# EAGLE design ver1.8 (EAGLE 9.6.2)
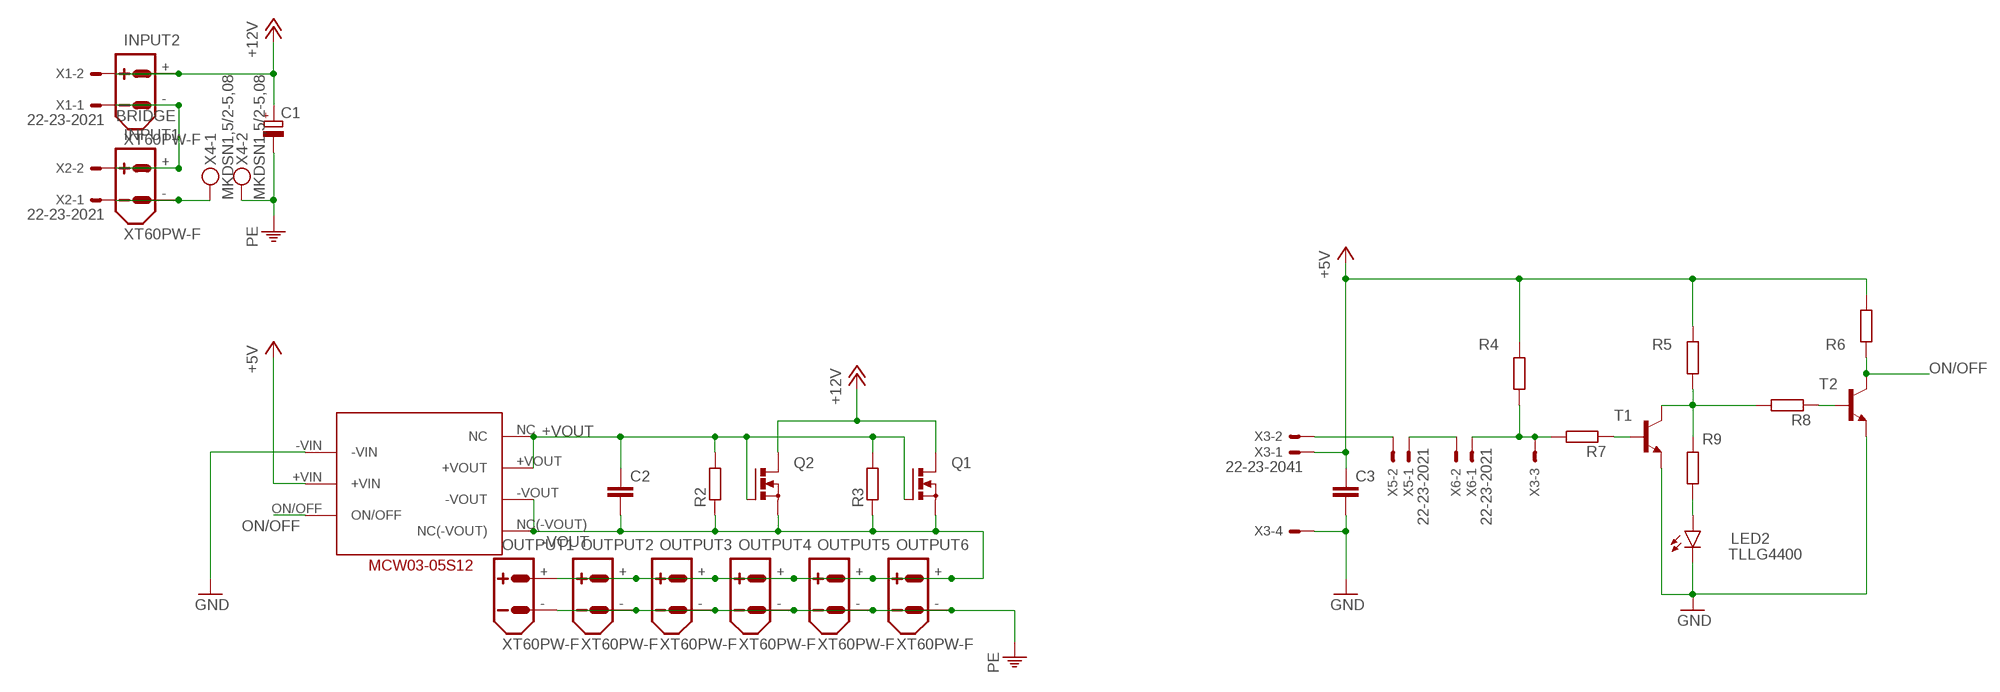
[diagram p0: schematic, sheet 1]

## Parts
C1  CPOL-EUE3.5-10  [E3,5-10]
C2  C-EU025-030X050  [C025-030X050]
C3  C-EU025-030X050  [C025-030X050]
INPUT1  XT60PW-F  [XT60PW-F]
INPUT2  XT60PW-F  [XT60PW-F]
LED2  TLLG4400  [LED3MM]
OUTPUT1  XT60PW-F  [XT60PW-F]
OUTPUT2  XT60PW-F  [XT60PW-F]
OUTPUT3  XT60PW-F  [XT60PW-F]
OUTPUT4  XT60PW-F  [XT60PW-F]
OUTPUT5  XT60PW-F  [XT60PW-F]
OUTPUT6  XT60PW-F  [XT60PW-F]
Q1  PMOSFET_NTO220BV  [TO220BV]
Q2  PMOSFET_NTO220BV  [TO220BV]
R2  R-EU_0204/5  [0204/5]
R3  R-EU_0204/5  [0204/5]
R4  R-EU_0204/5  [0204/5]
R5  R-EU_0204/5  [0204/5]
R6  R-EU_0204/5  [0204/5]
R7  R-EU_0204/5  [0204/5]
R8  R-EU_0204/5  [0204/5]
R9  R-EU_0204/5  [0204/5]
T1  -NPN-TO92-ECB  [TO92-ECB]
T2  -NPN-TO92-ECB  [TO92-ECB]
U$3  MCW03-05S12  [MCW03-05S12]
X1  22-23-2021  [22-23-2021]
X2  22-23-2021  [22-23-2021]
X3  22-23-2041  [22-23-2041]
X4  MKDSN1,5/2-5,08  [MKDSN1,5/2-5,08]
X5  22-23-2021  [22-23-2021]
X6  22-23-2021  [22-23-2021]

## Nets
+5V: C3.1 R4.2 R5.2 R6.2 U$3.+VIN X3.1
+12V: C1.+ INPUT2.+ Q1.D Q2.D X1.2
+VOUT: C2.1 Q1.G Q2.G R2.2 R3.2 U$3.+VOUT U$3.NC
-VOUT: C2.2 OUTPUT1.+ OUTPUT2.+ OUTPUT3.+ OUTPUT4.+ OUTPUT5.+ OUTPUT6.+ Q1.S Q2.S R2.1 R3.1 U$3.-VOUT U$3.NC(-VOUT)
BRIDGE: INPUT1.+ INPUT2.- X1.1 X2.2
GND: C3.2 LED2.K(C) T1.E T2.E U$3.-VIN X3.4
N$1: INPUT1.- X2.1 X4.1
N$7: X3.2 X5.2
N$8: X5.1 X6.2
N$9: R4.1 R7.2 X3.3 X6.1
N$10: R7.1 T1.B
N$12: R5.1 R8.2 R9.1 T1.C
N$14: R8.1 T2.B
N$15: LED2.A R9.2
ON/OFF: R6.1 T2.C U$3.ON/OFF
PE: C1.- OUTPUT1.- OUTPUT2.- OUTPUT3.- OUTPUT4.- OUTPUT5.- OUTPUT6.- X4.2

## Library data of the parts
C1 = rcl:CPOL-EU: POLARIZED CAPACITOR, European symbol; SPICEPREFIX: C
C2 C3 = rcl:C-EU: CAPACITOR, European symbol; SPICEPREFIX: C
INPUT1 INPUT2 OUTPUT1-OUTPUT6 = amass:XT60: AMASS XT60 connector Store in Japan AMASS XT60 connector <https://szc.jp/ams-xt60>
LED2 = led:TLLG4400: Low Current (2mA) LED 3 mm Tinted Diffused Package color GREEN Source: Data sheet <http://www.farnell.com/datasheets/391098.pdf>; MF: VISHAY SEMICONDUCTOR; OC_FARNELL: 1612435
Q1 Q2 = transistor-power:PMOSFET_N: Power MOSFET N-Channel
R2-R9 = rcl:R-EU_: RESISTOR, European symbol; SPICEPREFIX: R
T1 T2 = transistor:*-NPN-: NPN Transistror BF959 corrected 2008.03.06
U$3 = MCW03-05S12:MCW03-05S12
X1 X2 X5 X6 = con-molex:22-23-2021: .100" (2.54mm) Center Header - 2 Pin; MF: MOLEX; MPN: 22-23-2021; OC_FARNELL: 1462926; OC_NEWARK: 25C3832
X3 = con-molex:22-23-2041: .100" (2.54mm) Center Header - 4 Pin; MF: MOLEX; MPN: 22-23-2041; OC_FARNELL: 1462920; OC_NEWARK: 38C0355
X4 = con-phoenix-508:MKDSN1,5/2-5,08: MKDSN 1,5/ 2-5,08 Printklemme Nennstrom: 13,5 A Nennspannung: 250 V Rastermaß: 5,08 mm Polzahl: 2 Anschlussart: Schraubanschluss Montage: Löten Anschlussrichtung Leiter/Platine: 0 ° Artikelnummer: 1729128 Source: http://eshop.phoenixcontact.com .. 1729128.pdf

## Board
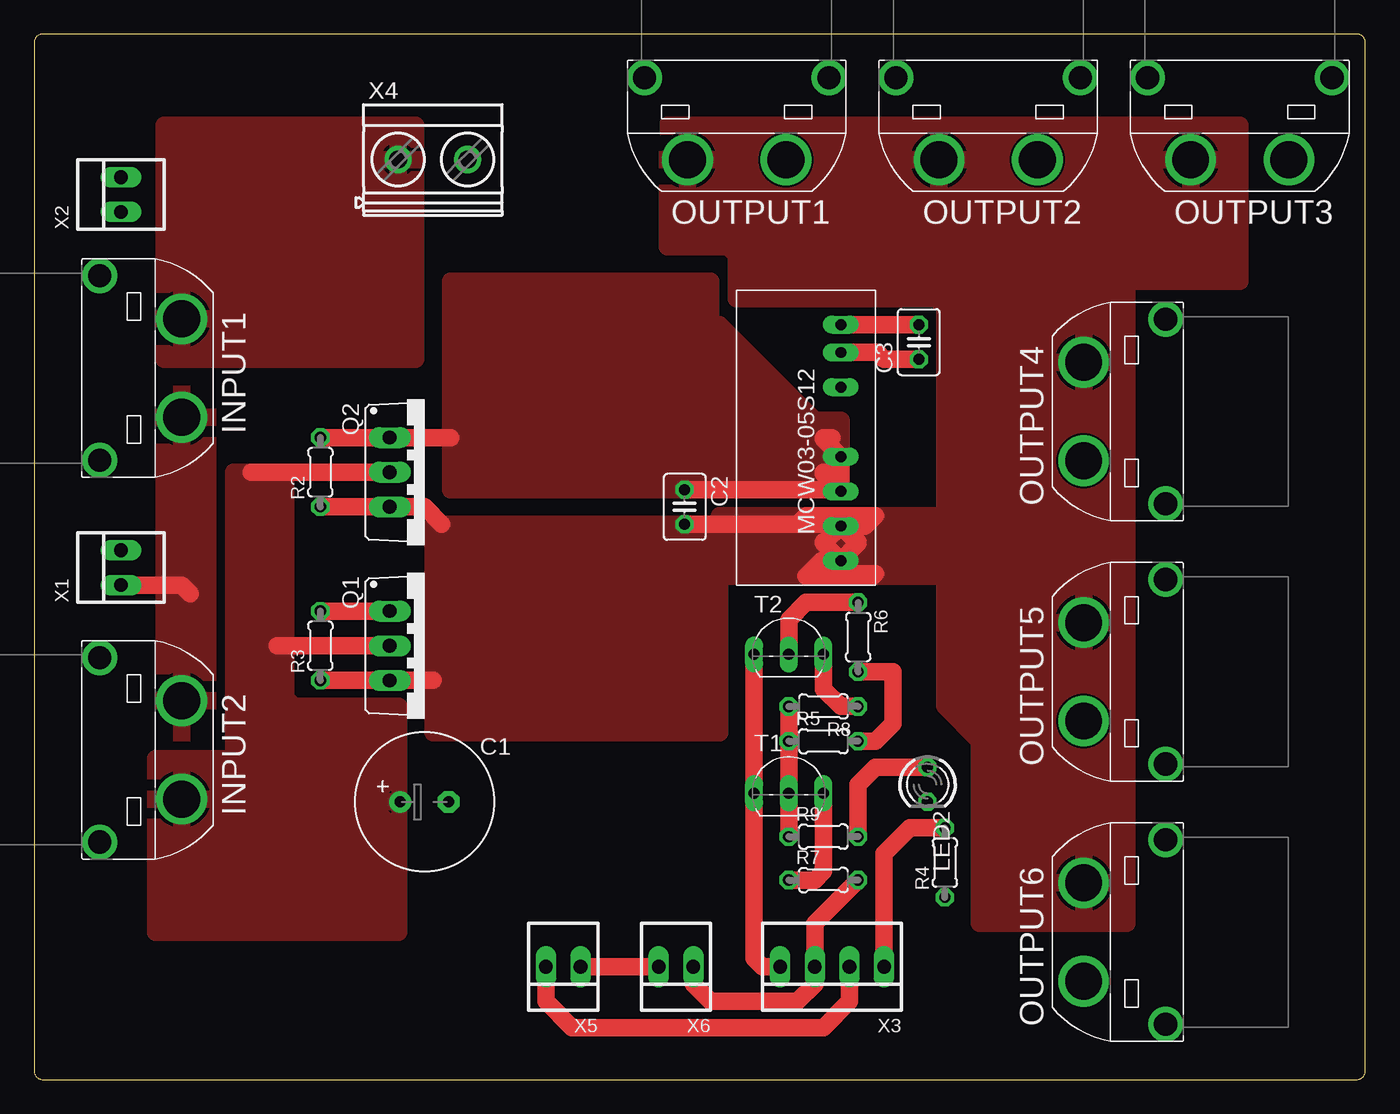
[diagram p1: board, top side]
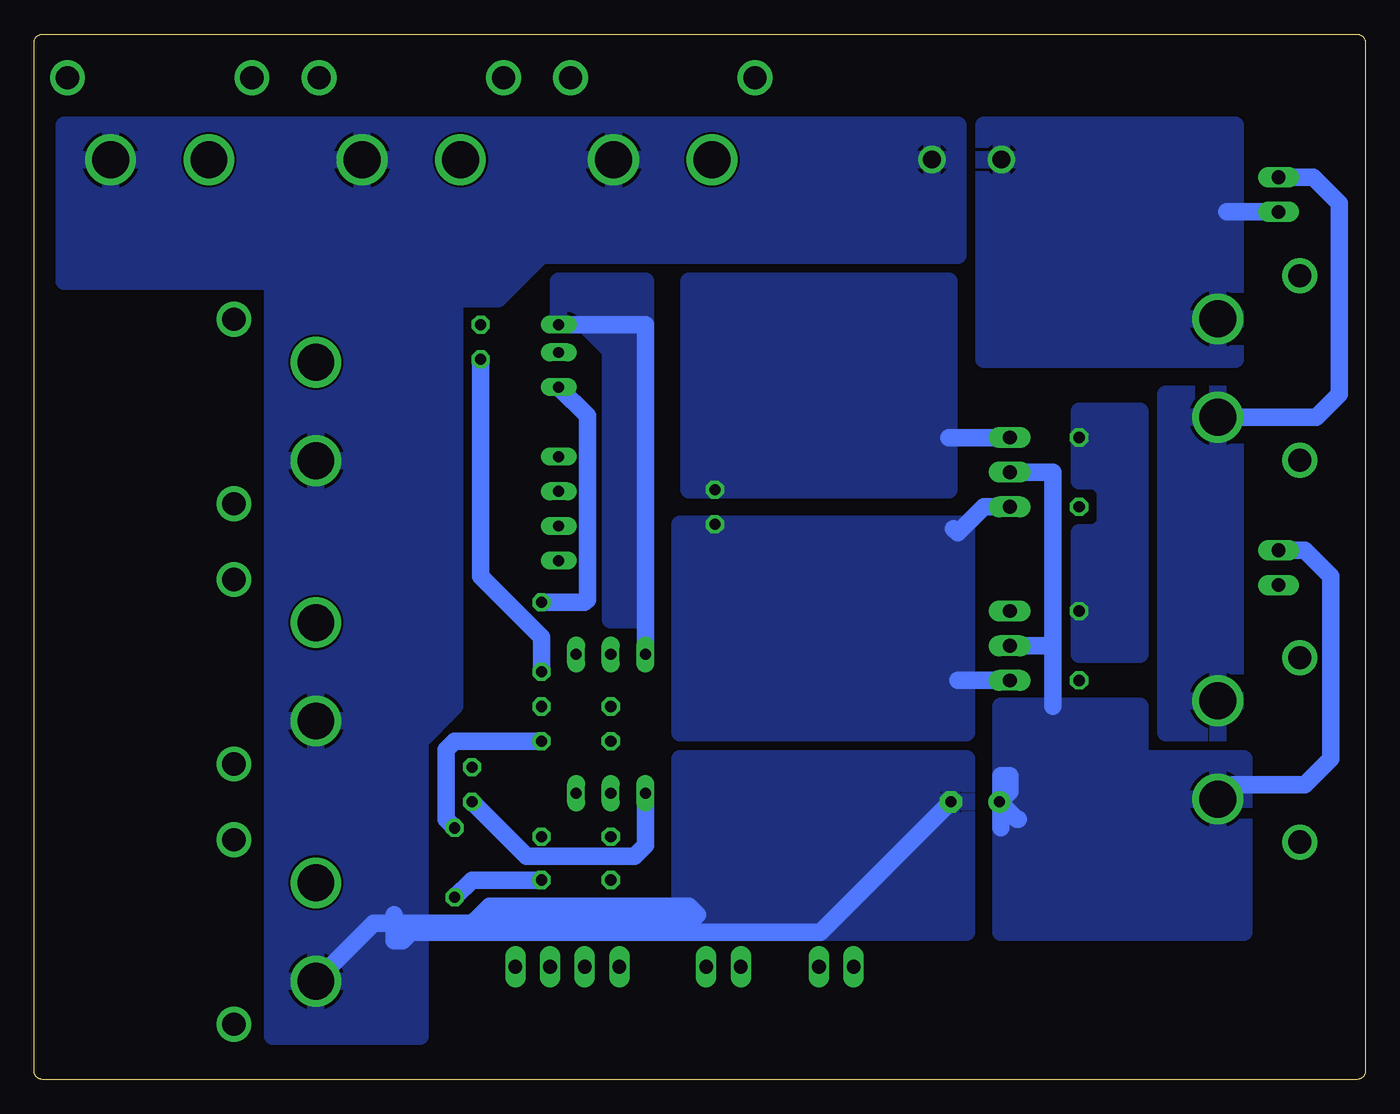
[diagram p2: board, bottom side, seen from below]

Size 97.46 x 76.51 mm. Coordinates in mm from the lower left corner, seen from the top.
Outline: 0,75.88 0,0.64 arc90 0.64,0 96.83,0 arc90 97.46,0.64 97.46,75.88 arc90 96.83,76.51 0.64,76.51 arc90 0,75.88
Copper layers (1*16): Top 0.035mm / dielectric 1.5mm / Bottom 0.035mm
Design rules "default": minimum track width 6mil, minimum drill 0.35mm, track to track 6mil, track to pad 6mil, pad to pad 6mil, via to via 6mil, smd to smd 6mil, copper to edge 40mil, drill to drill 6mil, minimum pad ring 10mil, minimum via ring 8mil, stop-mask expansion 4mil, vias tented up to drill 0mil, thermal gap 10mil

### Footprints (pad centres in the part's own frame; a part is rotated, then mirrored left to right if it is on the bottom)
E3,5-10 = drill 0.813 pad 1.6: + -1.778,0 | drill 0.813 pad 1.6 octagon: - 1.778,0
C025-030X050 = drill 0.813 octagon: 1 -1.27,0; 2 1.27,0
XT60PW-F = drill 2.7: + -3.6,0; - 3.6,0 | drill 1.7: P$3 -6.75,6; P$4 6.75,6
LED3MM = drill 0.813 octagon: A -1.27,0; K 1.27,0
TO220BV = drill 1.016 long: D 0,-2.54; G -2.54,-2.54; S 2.54,-2.54
0204/5 = drill 0.813 octagon: 1 -2.54,0; 2 2.54,0
TO92-ECB = drill 0.813 long: B 2.54,0; C 0,0; E -2.54,0
MCW03-05S12 = drill 0.8 long: +VIN -5.588,2.54; +VOUT 4.572,2.54; -VIN -7.62,2.54; -VOUT 7.112,2.54; NC 2.032,2.54; NC(-VOUT) 9.652,2.54; ON/OFF -3.048,2.54
22-23-2021 = drill 1 long: 1 -1.27,0; 2 1.27,0
22-23-2041 = drill 1 long: 1 -3.81,0; 2 -1.27,0; 3 1.27,0; 4 3.81,0
MKDSN1,5/2-5,08 = drill 1.3 pad 2: 1 -2.561,0.025; 2 2.519,0.025

### Placement (x,y rotation side)
C1  28.57,20.32 0 top
C2  47.62,41.91 270 top
C3  64.77,53.98 90 top
INPUT1  10.79,52.07 90 top
INPUT2  10.79,24.13 90 top
LED2  65.41,21.59 270 top
OUTPUT1  51.44,67.31 0 top
OUTPUT2  69.85,67.31 0 top
OUTPUT3  88.27,67.31 0 top
OUTPUT4  76.83,48.9 270 top
OUTPUT5  76.83,29.84 270 top
OUTPUT6  76.83,10.79 270 top
Q1  28.57,31.75 270 top
Q2  28.57,44.45 270 top
R2  20.95,44.45 90 top
R3  20.95,31.75 90 top
R4  66.67,15.88 90 top
R5  57.78,24.77 0 top
R6  60.33,32.38 270 top
R7  57.78,14.61 0 top
R8  57.78,27.3 180 top
R9  57.78,17.78 0 top
T1  55.24,20.95 0 top
T2  55.24,31.11 0 top
U$3  56.52,47.62 270 top
X1  6.35,37.47 90 top
X2  6.35,64.77 90 top
X3  58.42,8.26 180 top
X4  29.21,67.31 0 top
X5  38.73,8.26 180 top
X6  46.99,8.26 180 top

### Tracks (layer width: path | path; a pad name or v marks a point on that pad's centre or on a via)
+5V
  Top 1.27: R5.2 61.59,24.77 62.87,26.04 62.87,29.84 R6.2 | U$3.+VIN 61.72,53.21 62.23,52.7 C3.1 | R4.2 64.14,18.41 62.23,16.51 X3.1
  Bottom 1.27: R4.2 67.31,19.05 67.31,24.13 66.67,24.77 R5.2 | R6.2 60.33,32.38 64.77,36.83 C3.1
+12V
  Top 1.27: Q1.D 17.78,31.75 | Q2.D 15.88,44.45
  Bottom 1.27: Q2.D 22.86,44.45 22.86,31.75 | 22.86,31.75 Q1.D | 22.86,31.75 22.86,27.3 | C1.+ 26.67,20.45 26.67,22.23 26.04,22.23 26.04,21.08 C1.+ | C1.+ 25.53,19.05 25.4,19.05 | C1.+ 26.67,20.19 26.67,18.41 | X1.2 4.45,38.73 2.54,36.83 2.54,23.5 4.45,21.59 9.73,21.59 INPUT2.+
  pour Bottom: 16.51,27.3 26.67,27.3 26.67,10.79 8.89,10.79 8.89,23.5 16.51,23.5
  pour Top: 8.89,23.5 8.89,10.79 26.67,10.79 26.67,27.3 19.05,27.3 18.41,27.94 18.41,44.45 14.61,44.45 14.61,23.5
+VOUT
  Top 1.27: R3.2 Q1.G | R2.2 Q2.G 30.48,46.99 | C2.1 58.93,43.18 U$3.+VOUT 57.78,44.32 57.78,44.45 58.42,44.45 59.05,43.81 U$3.NC 57.78,46.86 57.78,46.99 58.42,46.99
  Bottom 1.27: Q2.G 30.48,46.99
  pour Bottom: 20.95,31.11 20.95,40.01 19.68,40.01 19.05,40.64 19.05,43.18 19.68,43.81 20.95,43.81 20.95,48.9 16.51,48.9 16.51,31.11
  pour Bottom: 30.48,43.18 49.53,43.18 49.53,58.42 30.48,58.42
  pour Top: 30.48,58.42 30.48,43.18 49.53,43.18 49.53,58.42
  pour Top: 48.26,43.18 59.05,43.18 59.05,48.26 57.15,48.26 50.16,55.24 49.53,55.24 48.26,53.98
-VOUT
  Top 1.27: R3.1 Q1.S 29.21,29.21 | R2.1 Q2.S 28.57,41.91 29.84,40.64 | C2.2 55.88,40.64 | 55.88,40.64 58.93,40.64 | 60.02,37.01 61.59,37.01 61.42,36.83 56.52,36.83 57.66,37.97 U$3.NC(-VOUT) | U$3.-VOUT 60.83,40.51 61.59,41.27 56.52,41.27 55.88,40.64 | U$3.-VOUT 60.2,39.37 60.33,39.37 60.33,39.24 U$3.NC(-VOUT) | U$3.NC(-VOUT) 57.78,39.24 | 57.78,39.24 57.78,39.37 | 57.78,39.24 U$3.-VOUT
  Bottom 1.27: Q2.S 27.94,41.91 29.84,40.01 30.16,40.32 | Q1.S 29.84,29.21
  pour Bottom: 50.16,40.64 50.16,25.4 29.21,25.4 29.21,40.64
  pour Top: 29.21,40.64 29.21,25.4 50.16,25.4 50.16,40.64
  pour Top: 46.35,69.85 46.35,60.96 50.8,60.96 51.44,60.33 51.44,57.15 66.04,57.15 66.67,56.52 66.67,27.3 69.22,24.77 69.22,11.43 80.01,11.43 80.01,58.42 88.27,58.42 88.27,69.85
  pour Top: 50.16,36.83 67.31,36.83 67.31,40.01 66.04,41.27 50.16,41.27
BRIDGE
  Top 1.27: X1.1 10.79,36.2 11.43,35.56
  Bottom 1.27: INPUT1.+ 3.6,48.47 1.91,50.16 1.91,64.14 3.81,66.04 X2.2
  pour Bottom: 9.53,25.4 9.53,50.16 14.61,50.16 14.61,25.4
  pour Top: 9.53,25.4 12.7,25.4 12.7,50.16 9.53,50.16
GND
  Top 1.27: T1.E T2.E 52.7,31.75 | T1.E 52.7,20.32 | U$3.-VIN C3.2 | T1.E 52.7,8.89 53.34,8.26 X3.4
  Bottom 1.27: U$3.-VIN 52.7,55.24 T2.E | T1.E 52.7,17.14 53.52,16.33 61.42,16.33 LED2.K
  pour Bottom: 59.05,55.24 57.15,55.24 55.24,53.34 55.24,33.66 52.7,33.66 52.7,58.42 59.05,58.42
N$1
  Bottom 1.27: X2.1 10.16,63.5
  pour Bottom: 9.53,52.7 27.94,52.7 27.94,69.85 9.53,69.85
  pour Top: 9.53,52.7 27.94,52.7 27.94,69.85 9.53,69.85
N$7
  Top 1.27: X3.2 59.69,5.71 57.78,3.81 39.37,3.81 37.47,5.71 X5.2
N$8
  Top 1.27: X6.2 X5.1
N$9
  Top 1.27: R7.2 57.15,11.43 X3.3 57.15,6.99 55.88,5.71 49.53,5.71 48.26,6.99 X6.1
  Bottom 1.27: R7.2 65.41,14.61 R4.1
N$10
  Top 1.27: R7.1 57.15,14.61 57.78,15.24 T1.B
N$12
  Top 1.27: R8.2 R5.1 T1.C | T1.C 55.24,20.32 | R9.1 T1.C
N$14
  Top 1.27: R8.1 59.05,27.3 57.78,28.57 T2.B 57.78,31.75
N$15
  Top 1.27: R9.2 60.33,21.59 61.59,22.86 LED2.A
ON/OFF
  Top 1.27: R6.1 56.52,34.92 55.24,33.66 T2.C 55.24,30.48
  Bottom 1.27: U$3.ON/OFF 56.96,48.58 56.96,35.12 57.15,34.92 R6.1
PE
  Bottom 1.27: C1.- 39.88,10.79 66.04,10.79 | OUTPUT6.- 72.6,11.43 49.53,11.43 48.9,12.06 49.53,12.7 64.14,12.7 66.04,10.79 | 66.04,10.79 69.85,10.79 70.48,10.16 71.12,10.16 71.12,12.06
  pour Bottom: 29.84,69.85 29.84,60.33 60.33,60.33 63.5,57.15 66.67,57.15 66.67,27.3 69.22,24.77 69.22,3.17 80.01,3.17 80.01,58.42 95.25,58.42 95.25,69.85
  pour Bottom: 29.21,23.5 29.21,10.79 50.16,10.79 50.16,23.5
  pour Bottom: 67.31,26.67 69.22,26.67 69.22,36.83